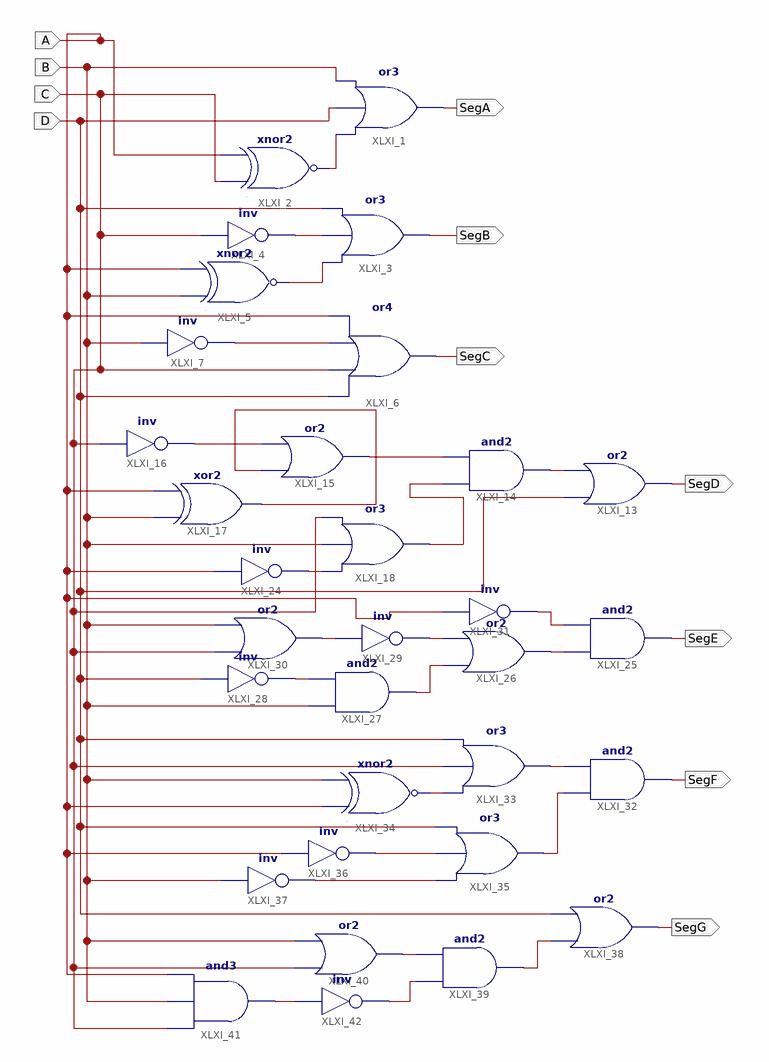
[diagram p0: schematic sheet 1]
// Xilinx ISE schematic sevensegment.sch (spartan6) as structural Verilog: 32 symbols, 11 ports
module sevensegment (
  input  C,
  input  B,
  input  A,
  input  D,
  output SegA,
  output SegC,
  output SegB,
  output SegD,
  output SegE,
  output SegF,
  output SegG
);

  wire XLXN_3, XLXN_9, XLXN_13, XLXN_25, XLXN_55, XLXN_60, XLXN_61, XLXN_64, XLXN_76, XLXN_79, XLXN_82,
       XLXN_83, XLXN_84, XLXN_87, XLXN_88, XLXN_91, XLXN_93, XLXN_96, XLXN_99, XLXN_102, XLXN_105, XLXN_111,
       XLXN_112, XLXN_113, XLXN_114;

  or XLXI_1 (SegA, XLXN_3, D, B);
  xnor XLXI_2 (XLXN_3, C, A);
  or XLXI_3 (SegB, XLXN_25, XLXN_9, D);
  not XLXI_4 (XLXN_9, C);
  xnor XLXI_5 (XLXN_25, B, A);
  or XLXI_6 (SegC, D, C, XLXN_13, A);
  not XLXI_7 (XLXN_13, B);
  or XLXI_15 (XLXN_55, XLXN_61, XLXN_60);
  xor XLXI_17 (XLXN_61, B, A);
  and XLXI_14 (XLXN_79, XLXN_64, XLXN_55);
  or XLXI_18 (XLXN_64, XLXN_76, B, C);
  not XLXI_16 (XLXN_60, C);
  not XLXI_24 (XLXN_76, A);
  or XLXI_13 (SegD, D, XLXN_79);
  and XLXI_25 (SegE, XLXN_82, XLXN_91);
  or XLXI_26 (XLXN_82, XLXN_83, XLXN_87);
  and XLXI_27 (XLXN_83, B, XLXN_84);
  not XLXI_28 (XLXN_84, D);
  not XLXI_29 (XLXN_87, XLXN_88);
  or XLXI_30 (XLXN_88, C, B);
  not XLXI_31 (XLXN_91, A);
  and XLXI_32 (SegF, XLXN_99, XLXN_93);
  or XLXI_33 (XLXN_93, XLXN_96, C, D);
  xnor XLXI_34 (XLXN_96, A, B);
  or XLXI_35 (XLXN_99, XLXN_105, XLXN_102, D);
  not XLXI_36 (XLXN_102, A);
  not XLXI_37 (XLXN_105, B);
  or XLXI_38 (SegG, XLXN_111, D);
  and XLXI_39 (XLXN_111, XLXN_114, XLXN_112);
  or XLXI_40 (XLXN_112, C, B);
  and XLXI_41 (XLXN_113, C, B, A);
  not XLXI_42 (XLXN_114, XLXN_113);
endmodule
